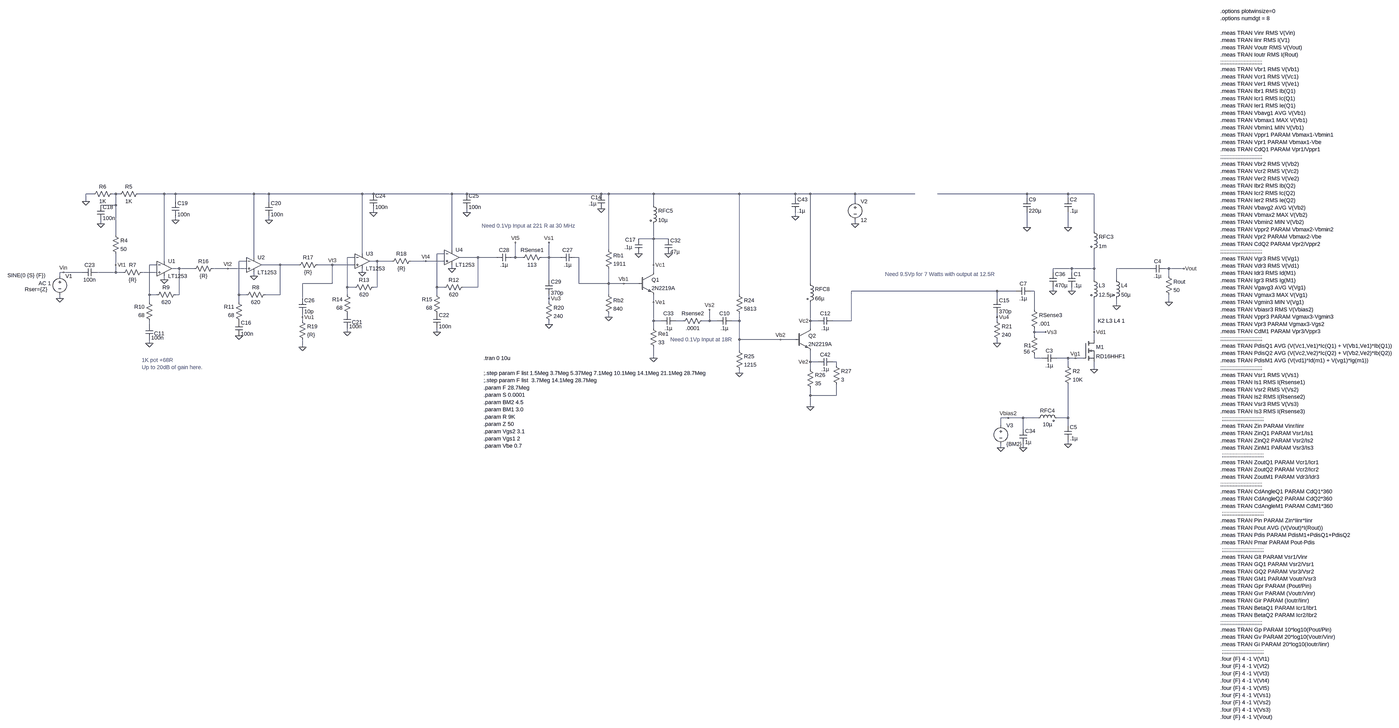
[diagram p0: schematic Temp.asc, whole sheet]
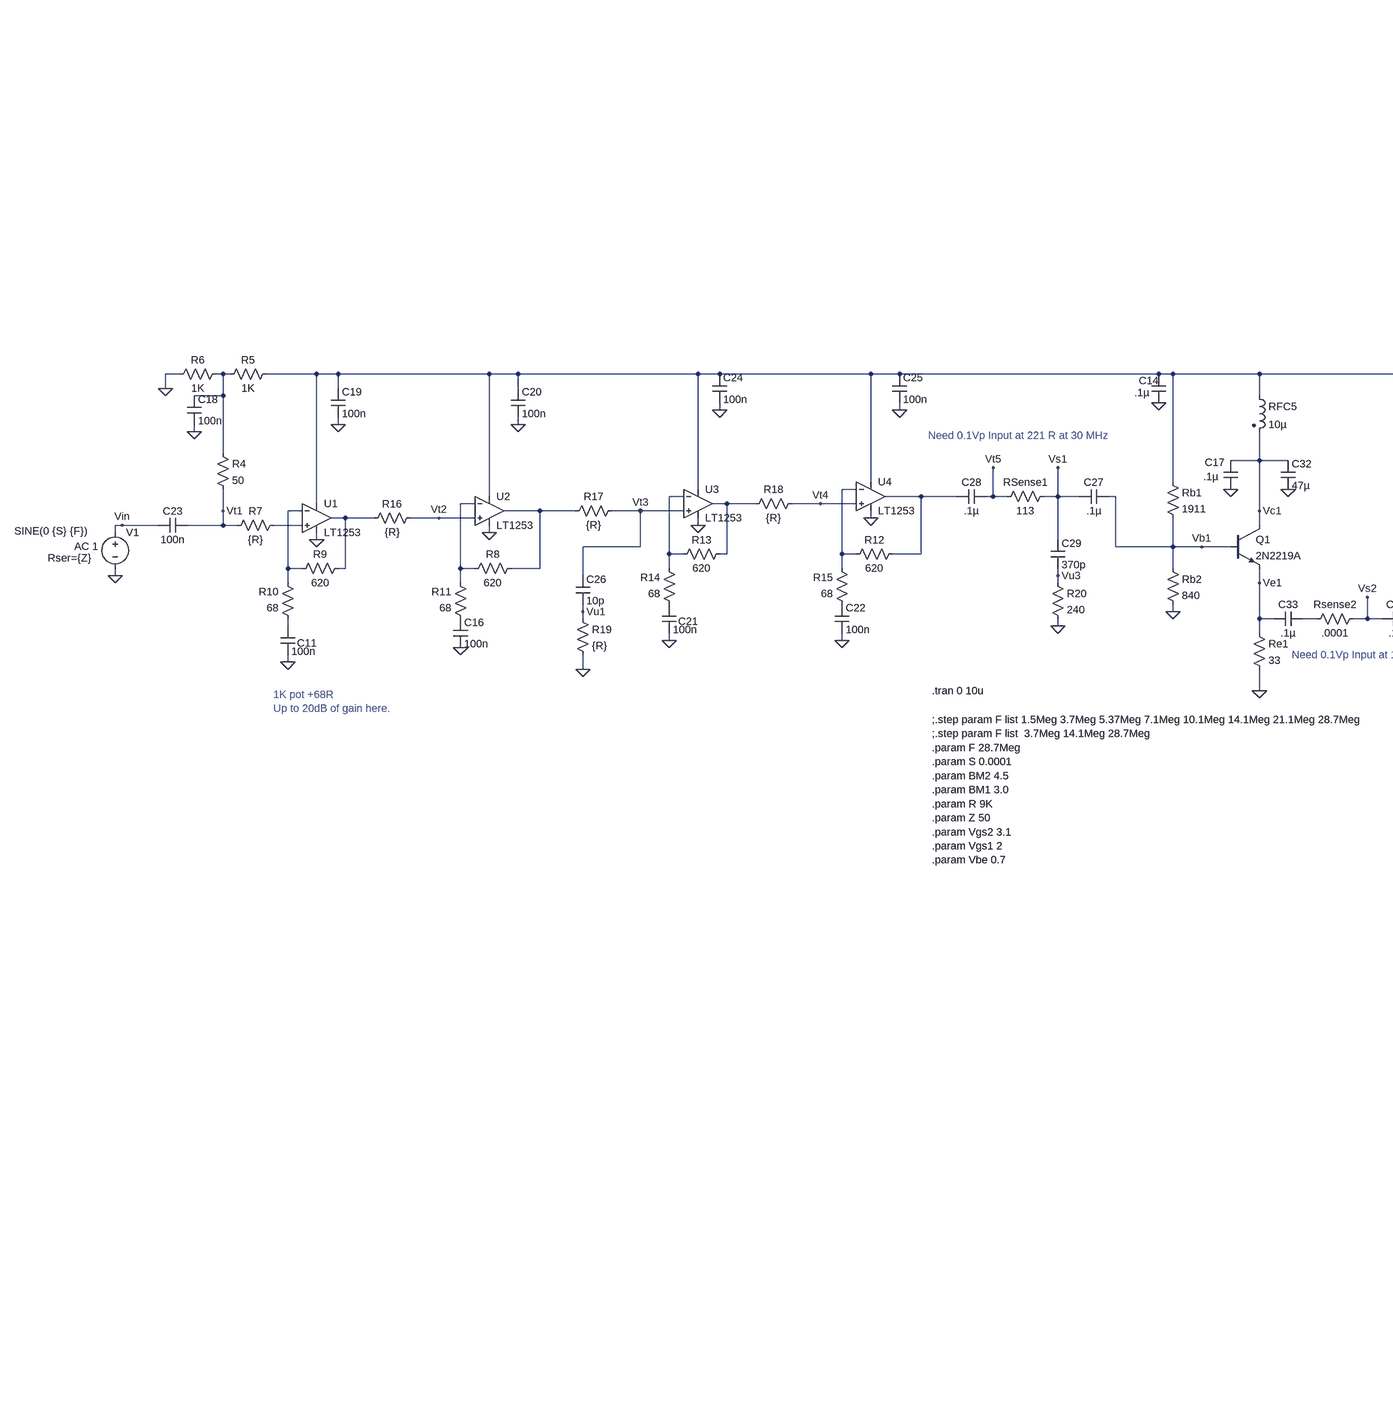
[diagram p1: schematic Temp.asc, part, row 1 of 1, column 1 of 2]
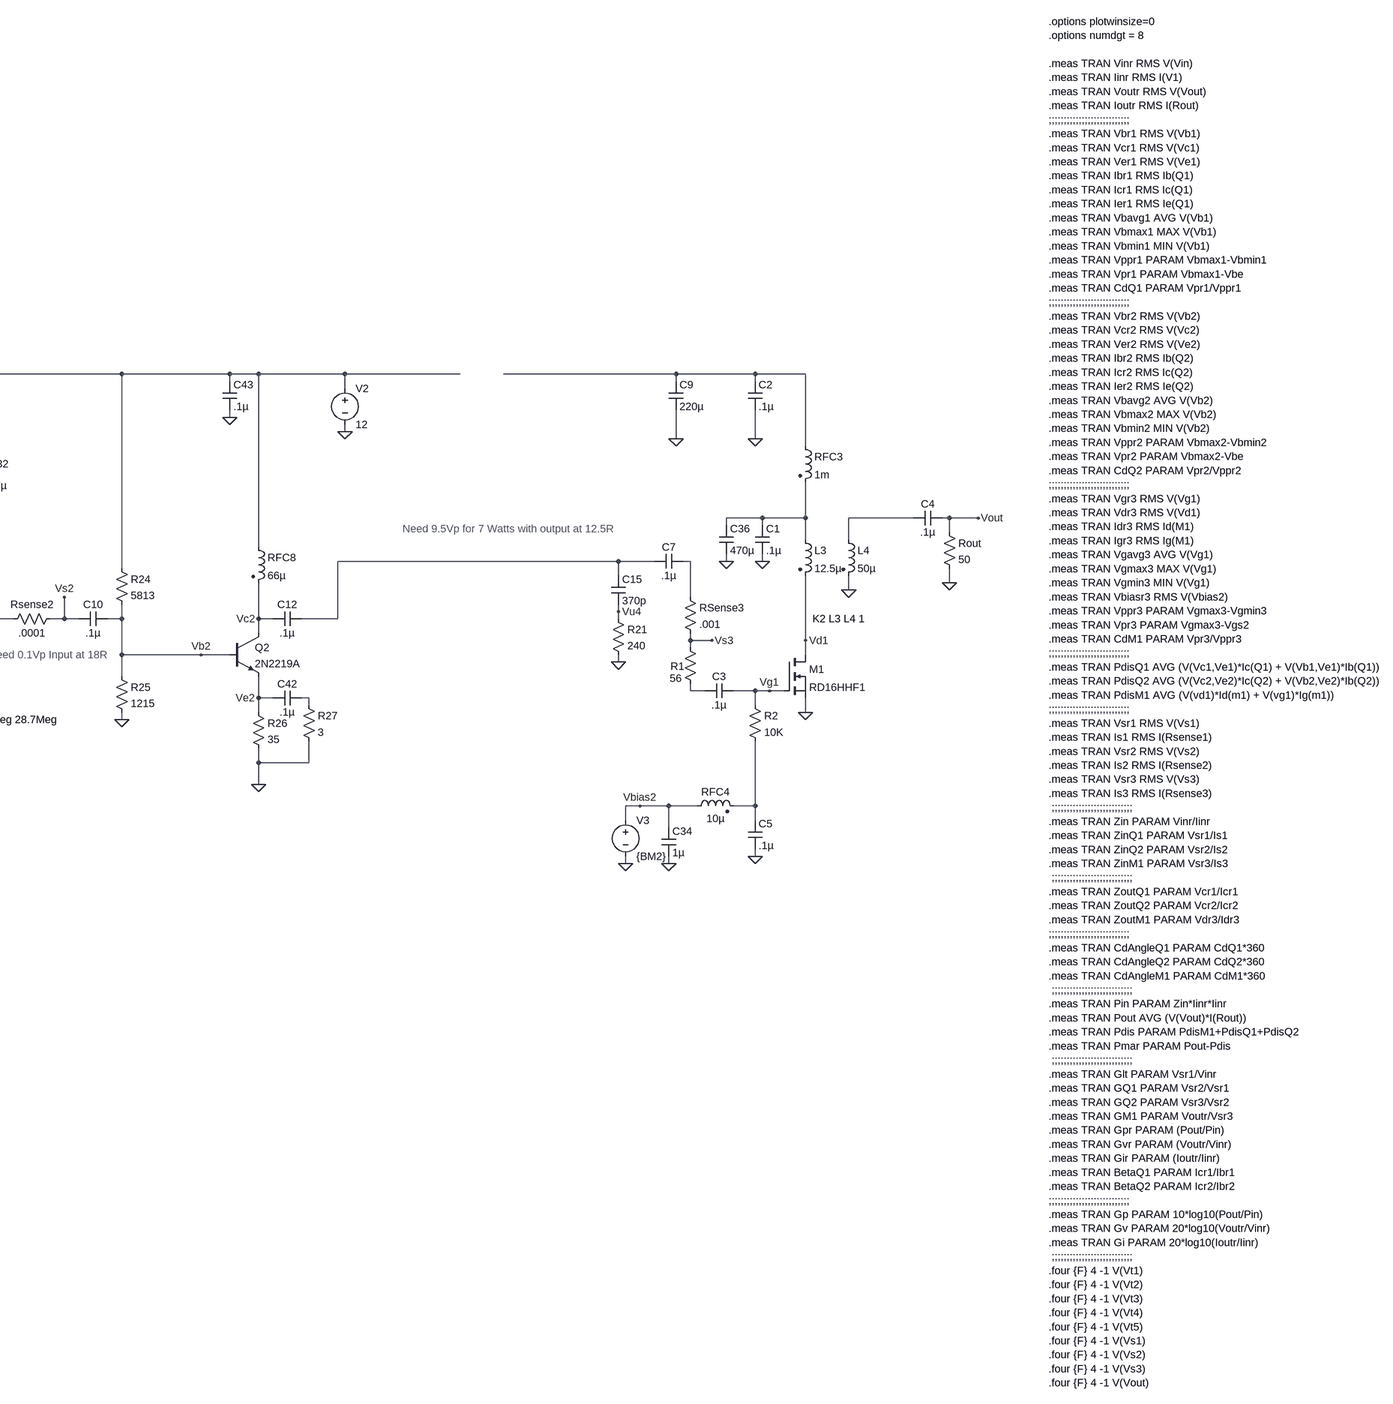
[diagram p2: schematic Temp.asc, part, row 1 of 1, column 2 of 2]
Temp.asc, the LTspice schematic file:
Version 4
SHEET 1 3484 2880
WIRE -3168 -160 -3200 -160
WIRE -3072 -160 -3088 -160
WIRE -3056 -160 -3072 -160
WIRE -2864 -160 -2976 -160
WIRE -2816 -160 -2864 -160
WIRE -2480 -160 -2816 -160
WIRE -2416 -160 -2480 -160
WIRE -2016 -160 -2416 -160
WIRE -1968 -160 -2016 -160
WIRE -1632 -160 -1968 -160
WIRE -1568 -160 -1632 -160
WIRE -992 -160 -1568 -160
WIRE -960 -160 -992 -160
WIRE -768 -160 -960 -160
WIRE -400 -160 -768 -160
WIRE -160 -160 -400 -160
WIRE -96 -160 -160 -160
WIRE 96 -160 -96 -160
WIRE 352 -160 96 -160
WIRE 832 -160 448 -160
WIRE 1008 -160 832 -160
WIRE 1120 -160 1008 -160
WIRE -160 -144 -160 -160
WIRE 832 -144 832 -160
WIRE 1008 -144 1008 -160
WIRE -3200 -128 -3200 -160
WIRE -2816 -128 -2816 -160
WIRE -2416 -128 -2416 -160
WIRE 96 -128 96 -160
WIRE -3072 -112 -3072 -160
WIRE -3072 -112 -3136 -112
WIRE -768 -112 -768 -160
WIRE -1968 -80 -1968 -96
WIRE -1568 -80 -1568 -96
WIRE -160 -64 -160 -80
WIRE -2816 -48 -2816 -64
WIRE -2416 -48 -2416 -64
WIRE -3136 -32 -3136 -48
WIRE 96 -32 96 -48
WIRE 832 -16 832 -80
WIRE 1008 -16 1008 -80
WIRE 1120 0 1120 -160
WIRE -3072 16 -3072 -112
WIRE -768 32 -768 -32
WIRE -768 32 -832 32
WIRE -704 32 -768 32
WIRE -1632 80 -1632 -160
WIRE -960 80 -960 -160
WIRE -2016 96 -2016 -160
WIRE -1664 96 -1696 96
WIRE -2480 112 -2480 -160
WIRE -2048 112 -2080 112
WIRE -1520 112 -1600 112
WIRE -1440 112 -1520 112
WIRE -1360 112 -1360 48
WIRE -1360 112 -1376 112
WIRE -1328 112 -1360 112
WIRE -1216 112 -1216 48
WIRE -1216 112 -1248 112
WIRE -1168 112 -1216 112
WIRE -1088 112 -1104 112
WIRE -2864 128 -2864 -160
WIRE -2512 128 -2544 128
WIRE -1952 128 -1984 128
WIRE -1888 128 -1952 128
WIRE -1744 128 -1808 128
WIRE -1664 128 -1744 128
WIRE -3072 144 -3072 96
WIRE -2896 144 -2928 144
WIRE -2368 144 -2448 144
WIRE -2288 144 -2368 144
WIRE -2144 144 -2208 144
WIRE -2048 144 -2144 144
WIRE -768 144 -768 32
WIRE -2800 160 -2832 160
WIRE -2736 160 -2800 160
WIRE -2592 160 -2656 160
WIRE -2512 160 -2592 160
WIRE -1632 160 -1632 144
WIRE 1024 160 944 160
WIRE 1120 160 1120 80
WIRE 1120 160 1024 160
WIRE 1360 160 1216 160
WIRE 1440 160 1424 160
WIRE 1504 160 1440 160
WIRE -3296 176 -3312 176
WIRE -3216 176 -3296 176
WIRE -3072 176 -3072 144
WIRE -3072 176 -3152 176
WIRE -3040 176 -3072 176
WIRE -2896 176 -2960 176
WIRE -2016 176 -2016 160
WIRE -768 176 -768 144
WIRE 944 176 944 160
WIRE 1024 176 1024 160
WIRE -3312 192 -3312 176
WIRE -2480 192 -2480 176
WIRE 1440 192 1440 160
WIRE -2864 208 -2864 192
WIRE -1216 208 -1216 112
WIRE 1120 208 1120 160
WIRE 1216 208 1216 160
WIRE -2144 224 -2144 144
WIRE -2144 224 -2272 224
WIRE -1088 224 -1088 112
WIRE -960 224 -960 160
WIRE -960 224 -1088 224
WIRE -896 224 -960 224
WIRE -832 224 -896 224
WIRE -96 224 -96 -160
WIRE -2080 240 -2080 112
WIRE -2048 240 -2080 240
WIRE -1952 240 -1952 128
WIRE -1952 240 -1968 240
WIRE -1696 240 -1696 96
WIRE -1664 240 -1696 240
WIRE -1520 240 -1520 112
WIRE -1520 240 -1584 240
WIRE 704 256 80 256
WIRE 784 256 704 256
WIRE 864 256 848 256
WIRE 944 256 944 240
WIRE 1024 256 1024 240
WIRE -2928 272 -2928 144
WIRE -2896 272 -2928 272
WIRE -2800 272 -2800 160
WIRE -2800 272 -2816 272
WIRE -2544 272 -2544 128
WIRE -2512 272 -2544 272
WIRE -2368 272 -2368 144
WIRE -2368 272 -2432 272
WIRE -2080 272 -2080 240
WIRE -1696 272 -1696 240
WIRE -960 272 -960 224
WIRE -400 272 -400 -160
WIRE -3312 288 -3312 272
WIRE -2272 288 -2272 224
WIRE -1216 288 -1216 272
WIRE 704 288 704 256
WIRE -2928 304 -2928 272
WIRE -2544 304 -2544 272
WIRE -1216 304 -1216 288
WIRE -768 304 -768 272
WIRE 1440 304 1440 272
WIRE 1216 320 1216 288
WIRE 864 336 864 256
WIRE -2272 368 -2272 352
WIRE -960 368 -960 352
WIRE 704 368 704 352
WIRE -2272 384 -2272 368
WIRE -768 384 -768 304
WIRE -736 384 -768 384
WIRE -640 384 -672 384
WIRE -528 384 -528 336
WIRE -528 384 -560 384
WIRE -496 384 -528 384
WIRE -400 384 -400 352
WIRE -400 384 -432 384
WIRE -96 384 -96 304
WIRE -64 384 -96 384
WIRE 80 384 80 256
WIRE 80 384 0 384
WIRE 704 384 704 368
WIRE -2928 400 -2928 384
WIRE -1216 400 -1216 384
WIRE -768 416 -768 384
WIRE -96 416 -96 384
WIRE -2080 432 -2080 416
WIRE -1696 432 -1696 416
WIRE 864 432 864 416
WIRE 912 432 864 432
WIRE 1120 432 1120 288
WIRE 864 448 864 432
WIRE -400 464 -400 384
WIRE -224 464 -400 464
WIRE -160 464 -224 464
WIRE 1120 464 1120 432
WIRE -2928 480 -2928 464
WIRE 704 480 704 464
WIRE -2272 496 -2272 464
WIRE -400 512 -400 464
WIRE -768 544 -768 496
WIRE 864 544 864 528
WIRE 896 544 864 544
WIRE 1008 544 960 544
WIRE 1040 544 1008 544
WIRE 1072 544 1040 544
WIRE -96 560 -96 512
WIRE -64 560 -96 560
WIRE 16 560 0 560
WIRE 16 576 16 560
WIRE 1008 576 1008 544
WIRE -96 592 -96 560
WIRE 1120 592 1120 560
WIRE -400 608 -400 592
WIRE -96 704 -96 672
WIRE 16 704 16 656
WIRE 16 704 -96 704
WIRE -96 752 -96 704
WIRE 752 800 720 800
WIRE 816 800 752 800
WIRE 880 800 816 800
WIRE 1008 800 1008 656
WIRE 1008 800 960 800
WIRE 720 832 720 800
WIRE 1008 832 1008 800
WIRE 816 848 816 800
WIRE 1008 912 1008 896
WIRE 720 928 720 912
WIRE 816 928 816 912
FLAG 1440 304 0
FLAG 1504 160 Vout
FLAG -3312 288 0
FLAG -3296 176 Vin
FLAG 1120 592 0
FLAG 1040 544 Vg1
FLAG 1120 432 Vd1
FLAG 1024 256 0
FLAG 1008 -16 0
FLAG 1216 320 0
FLAG 1008 912 0
FLAG 912 432 Vs3
FLAG 720 928 0
FLAG 752 800 Vbias2
FLAG 832 -16 0
FLAG 944 256 0
FLAG -960 368 0
FLAG -768 544 0
FLAG -896 224 Vb1
FLAG -768 304 Ve1
FLAG -768 144 Vc1
FLAG -992 -96 0
FLAG -832 96 0
FLAG -704 96 0
FLAG 704 368 Vu4
FLAG 704 480 0
FLAG 816 928 0
FLAG 96 -32 0
FLAG -400 608 0
FLAG -96 752 0
FLAG -224 464 Vb2
FLAG -96 560 Ve2
FLAG -96 384 Vc2
FLAG -160 -64 0
FLAG -528 336 Vs2
FLAG -2816 -48 0
FLAG -3136 -32 0
FLAG -2864 208 0
FLAG -2480 192 0
FLAG -2544 448 0
FLAG -2416 -48 0
FLAG -3200 -128 0
FLAG -2928 480 0
FLAG -1968 -80 0
FLAG -2016 176 0
FLAG -1632 160 0
FLAG -1696 432 0
FLAG -1568 -80 0
FLAG -2080 432 0
FLAG -2272 368 Vu1
FLAG -2272 496 0
FLAG -1216 48 Vs1
FLAG -3072 144 Vt1
FLAG -2592 160 Vt2
FLAG -2144 144 Vt3
FLAG -1360 48 Vt5
FLAG -1744 128 Vt4
FLAG -1216 288 Vu3
FLAG -1216 400 0
SYMBOL res 1424 176 R0
SYMATTR InstName Rout
SYMATTR Value 50
SYMBOL voltage -3312 176 R0
WINDOW 123 -91 47 Left 2
WINDOW 39 -150 73 Left 2
WINDOW 3 -224 13 Left 2
SYMATTR Value2 AC 1
SYMATTR SpiceLine Rser={Z}
SYMATTR Value SINE(0 {S} {F})
SYMATTR InstName V1
SYMBOL cap 1360 176 R270
WINDOW 0 32 32 VTop 2
WINDOW 3 0 32 VBottom 2
SYMATTR InstName C4
SYMATTR Value .1µ
SYMBOL nmos 1072 464 R0
SYMATTR InstName M1
SYMATTR Value RD16HHF1
SYMBOL ind2 1104 192 R0
SYMATTR InstName L3
SYMATTR Value 12.5µ
SYMATTR Type ind
SYMBOL ind2 1104 -16 R0
SYMATTR InstName RFC3
SYMATTR Value 1m
SYMATTR Type ind
SYMBOL cap 1008 176 R0
SYMATTR InstName C1
SYMATTR Value .1µ
SYMBOL ind2 1200 192 R0
SYMATTR InstName L4
SYMATTR Value 50µ
SYMATTR Type ind
SYMBOL cap 992 -144 R0
SYMATTR InstName C2
SYMATTR Value .1µ
SYMBOL res 848 320 R0
SYMATTR InstName RSense3
SYMATTR Value .001
SYMBOL cap 960 528 R90
WINDOW 0 0 32 VBottom 2
WINDOW 3 32 32 VTop 2
SYMATTR InstName C3
SYMATTR Value .1µ
SYMBOL res 992 560 R0
SYMATTR InstName R2
SYMATTR Value 10K
SYMBOL ind2 864 816 R270
WINDOW 0 32 56 VTop 2
WINDOW 3 4 56 VBottom 2
SYMATTR InstName RFC4
SYMATTR Value 10µ
SYMATTR Type ind
SYMBOL cap 992 832 R0
SYMATTR InstName C5
SYMATTR Value .1µ
SYMBOL cap 784 272 R270
WINDOW 0 32 32 VTop 2
WINDOW 3 0 32 VBottom 2
SYMATTR InstName C7
SYMATTR Value .1µ
SYMBOL voltage 720 816 R0
WINDOW 123 0 0 Left 2
WINDOW 39 0 0 Left 2
SYMATTR InstName V3
SYMATTR Value {BM2}
SYMBOL cap 816 -144 R0
SYMATTR InstName C9
SYMATTR Value 220µ
SYMBOL cap 928 176 R0
SYMATTR InstName C36
SYMATTR Value 470µ
SYMBOL res 848 432 R0
WINDOW 0 -28 58 Left 2
WINDOW 3 -30 84 Left 2
SYMATTR InstName R1
SYMATTR Value 56
SYMBOL res -976 64 R0
SYMATTR InstName Rb1
SYMATTR Value 1911
SYMBOL res -976 256 R0
SYMATTR InstName Rb2
SYMATTR Value 840
SYMBOL res -784 400 R0
SYMATTR InstName Re1
SYMATTR Value 33
SYMBOL npn -832 176 R0
SYMATTR InstName Q1
SYMATTR Value 2N2219A
SYMBOL cap -1008 -160 R0
WINDOW 0 -28 15 Left 2
WINDOW 3 -38 41 Left 2
SYMATTR InstName C14
SYMATTR Value .1µ
SYMBOL cap -848 32 R0
WINDOW 0 -41 4 Left 2
WINDOW 3 -45 36 Left 2
SYMATTR InstName C17
SYMATTR Value .1µ
SYMBOL cap -3152 160 R90
WINDOW 0 0 32 VBottom 2
WINDOW 3 32 32 VTop 2
SYMATTR InstName C23
SYMATTR Value 100n
SYMBOL ind2 -784 -128 R0
SYMATTR InstName RFC5
SYMATTR Value 10µ
SYMATTR Type ind
SYMBOL cap -720 32 R0
SYMATTR InstName C32
SYMATTR Value 47µ
SYMBOL cap -736 400 R270
WINDOW 0 32 32 VTop 2
WINDOW 3 0 32 VBottom 2
SYMATTR InstName C33
SYMATTR Value .1µ
SYMBOL cap 688 288 R0
SYMATTR InstName C15
SYMATTR Value 370p
SYMBOL res 688 368 R0
SYMATTR InstName R21
SYMATTR Value 240
SYMBOL cap 800 848 R0
SYMATTR InstName C34
SYMATTR Value 1µ
SYMBOL voltage 96 -144 R0
WINDOW 123 0 0 Left 2
WINDOW 39 0 0 Left 2
SYMATTR InstName V2
SYMATTR Value 12
SYMBOL cap -64 400 R270
WINDOW 0 32 32 VTop 2
WINDOW 3 0 32 VBottom 2
SYMATTR InstName C12
SYMATTR Value .1µ
SYMBOL res -416 256 R0
SYMATTR InstName R24
SYMATTR Value 5813
SYMBOL res -416 496 R0
SYMATTR InstName R25
SYMATTR Value 1215
SYMBOL res -112 576 R0
SYMATTR InstName R26
SYMATTR Value 35
SYMBOL cap 0 544 R90
WINDOW 0 0 32 VBottom 2
WINDOW 3 32 32 VTop 2
SYMATTR InstName C42
SYMATTR Value .1µ
SYMBOL npn -160 416 R0
SYMATTR InstName Q2
SYMATTR Value 2N2219A
SYMBOL res 0 560 R0
SYMATTR InstName R27
SYMATTR Value 3
SYMBOL ind2 -112 208 R0
SYMATTR InstName RFC8
SYMATTR Value 66µ
SYMATTR Type ind
SYMBOL cap -176 -144 R0
SYMATTR InstName C43
SYMATTR Value .1µ
SYMBOL res -544 368 R90
WINDOW 0 0 56 VBottom 2
WINDOW 3 32 56 VTop 2
SYMATTR InstName Rsense2
SYMATTR Value .0001
SYMBOL cap -496 400 R270
WINDOW 0 32 32 VTop 2
WINDOW 3 0 32 VBottom 2
SYMATTR InstName C10
SYMATTR Value .1µ
SYMBOL Opamps\\LT1253 -2864 96 R0
SYMATTR InstName U1
SYMBOL Opamps\\LT1253 -2480 80 R0
SYMATTR InstName U2
SYMBOL res -3088 0 R0
SYMATTR InstName R4
SYMATTR Value 50
SYMBOL res -2960 -176 R90
WINDOW 0 0 56 VBottom 2
WINDOW 3 32 56 VTop 2
SYMATTR InstName R5
SYMATTR Value 1K
SYMBOL res -3072 -176 R90
WINDOW 0 0 56 VBottom 2
WINDOW 3 32 56 VTop 2
SYMATTR InstName R6
SYMATTR Value 1K
SYMBOL res -2944 160 R90
WINDOW 0 0 56 VBottom 2
WINDOW 3 32 56 VTop 2
SYMATTR InstName R7
SYMATTR Value {R}
SYMBOL res -2416 256 R90
WINDOW 0 0 56 VBottom 2
WINDOW 3 32 56 VTop 2
SYMATTR InstName R8
SYMATTR Value 620
SYMBOL res -2800 256 R90
WINDOW 0 0 56 VBottom 2
WINDOW 3 32 56 VTop 2
SYMATTR InstName R9
SYMATTR Value 620
SYMBOL res -2912 400 R180
WINDOW 0 36 76 Left 2
WINDOW 3 36 40 Left 2
SYMATTR InstName R10
SYMATTR Value 68
SYMBOL res -2528 400 R180
WINDOW 0 36 76 Left 2
WINDOW 3 36 40 Left 2
SYMATTR InstName R11
SYMATTR Value 68
SYMBOL cap -2944 400 R0
WINDOW 0 36 38 Left 2
SYMATTR InstName C11
SYMATTR Value 100n
SYMBOL cap -2560 384 R0
SYMATTR InstName C16
SYMATTR Value 100n
SYMBOL cap -3152 -112 R0
SYMATTR InstName C18
SYMATTR Value 100n
SYMBOL cap -2832 -128 R0
SYMATTR InstName C19
SYMATTR Value 100n
SYMBOL cap -2432 -128 R0
SYMATTR InstName C20
SYMATTR Value 100n
SYMBOL Opamps\\LT1253 -2016 64 R0
SYMATTR InstName U3
SYMBOL Opamps\\LT1253 -1632 48 R0
SYMATTR InstName U4
SYMBOL res -1568 224 R90
WINDOW 0 0 56 VBottom 2
WINDOW 3 32 56 VTop 2
SYMATTR InstName R12
SYMATTR Value 620
SYMBOL res -1952 224 R90
WINDOW 0 0 56 VBottom 2
WINDOW 3 32 56 VTop 2
SYMATTR InstName R13
SYMATTR Value 620
SYMBOL res -2064 368 R180
WINDOW 0 36 76 Left 2
WINDOW 3 36 40 Left 2
SYMATTR InstName R14
SYMATTR Value 68
SYMBOL res -1680 368 R180
WINDOW 0 36 76 Left 2
WINDOW 3 36 40 Left 2
SYMATTR InstName R15
SYMATTR Value 68
SYMBOL cap -2096 352 R0
WINDOW 0 36 38 Left 2
SYMATTR InstName C21
SYMATTR Value 100n
SYMBOL cap -1712 352 R0
SYMATTR InstName C22
SYMATTR Value 100n
SYMBOL cap -1984 -160 R0
SYMATTR InstName C24
SYMATTR Value 100n
SYMBOL cap -1584 -160 R0
SYMATTR InstName C25
SYMATTR Value 100n
SYMBOL res -2640 144 R90
WINDOW 0 0 56 VBottom 2
WINDOW 3 32 56 VTop 2
SYMATTR InstName R16
SYMATTR Value {R}
SYMBOL res -2192 128 R90
WINDOW 0 0 56 VBottom 2
WINDOW 3 32 56 VTop 2
SYMATTR InstName R17
SYMATTR Value {R}
SYMBOL res -1792 112 R90
WINDOW 0 0 56 VBottom 2
WINDOW 3 32 56 VTop 2
SYMATTR InstName R18
SYMATTR Value {R}
SYMBOL cap -2288 288 R0
SYMATTR InstName C26
SYMATTR Value 10p
SYMBOL res -2288 368 R0
SYMATTR InstName R19
SYMATTR Value {R}
SYMBOL cap -1168 128 R270
WINDOW 0 32 32 VTop 2
WINDOW 3 0 32 VBottom 2
SYMATTR InstName C27
SYMATTR Value .1µ
SYMBOL cap -1440 128 R270
WINDOW 0 32 32 VTop 2
WINDOW 3 0 32 VBottom 2
SYMATTR InstName C28
SYMATTR Value .1µ
SYMBOL res -1232 96 R90
WINDOW 0 0 56 VBottom 2
WINDOW 3 32 56 VTop 2
SYMATTR InstName RSense1
SYMATTR Value 113
SYMBOL cap -1232 208 R0
SYMATTR InstName C29
SYMATTR Value 370p
SYMBOL res -1232 288 R0
SYMATTR InstName R20
SYMATTR Value 240
TEXT -1496 544 Left 2 !.tran 0 10u
TEXT 2696 -944 Left 2 !.options plotwinsize=0\n.options numdgt = 8\n \n.meas TRAN Vinr RMS V(Vin)\n.meas TRAN Iinr RMS I(V1)\n.meas TRAN Voutr RMS V(Vout)\n.meas TRAN Ioutr RMS I(Rout)\n;;;;;;;;;;;;;;;;;;;;;;;;;;;\n.meas TRAN Vbr1 RMS V(Vb1)\n.meas TRAN Vcr1 RMS V(Vc1)\n.meas TRAN Ver1 RMS V(Ve1)\n.meas TRAN Ibr1 RMS Ib(Q1)\n.meas TRAN Icr1 RMS Ic(Q1)\n.meas TRAN Ier1 RMS Ie(Q1)\n.meas TRAN Vbavg1 AVG V(Vb1)\n.meas TRAN Vbmax1 MAX V(Vb1)\n.meas TRAN Vbmin1 MIN V(Vb1)\n.meas TRAN Vppr1 PARAM Vbmax1-Vbmin1\n.meas TRAN Vpr1 PARAM Vbmax1-Vbe\n.meas TRAN CdQ1 PARAM Vpr1/Vppr1\n;;;;;;;;;;;;;;;;;;;;;;;;;;;\n.meas TRAN Vbr2 RMS V(Vb2)\n.meas TRAN Vcr2 RMS V(Vc2)\n.meas TRAN Ver2 RMS V(Ve2)\n.meas TRAN Ibr2 RMS Ib(Q2)\n.meas TRAN Icr2 RMS Ic(Q2)\n.meas TRAN Ier2 RMS Ie(Q2)\n.meas TRAN Vbavg2 AVG V(Vb2)\n.meas TRAN Vbmax2 MAX V(Vb2)\n.meas TRAN Vbmin2 MIN V(Vb2)\n.meas TRAN Vppr2 PARAM Vbmax2-Vbmin2\n.meas TRAN Vpr2 PARAM Vbmax2-Vbe\n.meas TRAN CdQ2 PARAM Vpr2/Vppr2\n;;;;;;;;;;;;;;;;;;;;;;;;;;;\n.meas TRAN Vgr3 RMS V(Vg1)\n.meas TRAN Vdr3 RMS V(Vd1)\n.meas TRAN Idr3 RMS Id(M1)\n.meas TRAN Igr3 RMS Ig(M1)\n.meas TRAN Vgavg3 AVG V(Vg1)\n.meas TRAN Vgmax3 MAX V(Vg1)\n.meas TRAN Vgmin3 MIN V(Vg1)\n.meas TRAN Vbiasr3 RMS V(Vbias2)\n.meas TRAN Vppr3 PARAM Vgmax3-Vgmin3\n.meas TRAN Vpr3 PARAM Vgmax3-Vgs2\n.meas TRAN CdM1 PARAM Vpr3/Vppr3\n;;;;;;;;;;;;;;;;;;;;;;;;;;;\n.meas TRAN PdisQ1 AVG (V(Vc1,Ve1)*Ic(Q1) + V(Vb1,Ve1)*Ib(Q1))\n.meas TRAN PdisQ2 AVG (V(Vc2,Ve2)*Ic(Q2) + V(Vb2,Ve2)*Ib(Q2))\n.meas TRAN PdisM1 AVG (V(vd1)*Id(m1) + V(vg1)*Ig(m1))\n;;;;;;;;;;;;;;;;;;;;;;;;;;;\n.meas TRAN Vsr1 RMS V(Vs1)\n.meas TRAN Is1 RMS I(Rsense1)\n.meas TRAN Vsr2 RMS V(Vs2)\n.meas TRAN Is2 RMS I(Rsense2)\n.meas TRAN Vsr3 RMS V(Vs3)\n.meas TRAN Is3 RMS I(Rsense3)\n ;;;;;;;;;;;;;;;;;;;;;;;;;;;\n.meas TRAN Zin PARAM Vinr/Iinr\n.meas TRAN ZinQ1 PARAM Vsr1/Is1\n.meas TRAN ZinQ2 PARAM Vsr2/Is2\n.meas TRAN ZinM1 PARAM Vsr3/Is3\n ;;;;;;;;;;;;;;;;;;;;;;;;;;; \n.meas TRAN ZoutQ1 PARAM Vcr1/Icr1\n.meas TRAN ZoutQ2 PARAM Vcr2/Icr2\n.meas TRAN ZoutM1 PARAM Vdr3/Idr3\n;;;;;;;;;;;;;;;;;;;;;;;;;;;\n.meas TRAN CdAngleQ1 PARAM CdQ1*360\n.meas TRAN CdAngleQ2 PARAM CdQ2*360\n.meas TRAN CdAngleM1 PARAM CdM1*360\n ;;;;;;;;;;;;;;;;;;;;;;;;;;;\n.meas TRAN Pin PARAM Zin*Iinr*Iinr\n.meas TRAN Pout AVG (V(Vout)*I(Rout))\n.meas TRAN Pdis PARAM PdisM1+PdisQ1+PdisQ2\n.meas TRAN Pmar PARAM Pout-Pdis\n ;;;;;;;;;;;;;;;;;;;;;;;;;;;\n.meas TRAN Glt PARAM Vsr1/Vinr\n.meas TRAN GQ1 PARAM Vsr2/Vsr1\n.meas TRAN GQ2 PARAM Vsr3/Vsr2\n.meas TRAN GM1 PARAM Voutr/Vsr3\n.meas TRAN Gpr PARAM (Pout/Pin)\n.meas TRAN Gvr PARAM (Voutr/Vinr)\n.meas TRAN Gir PARAM (Ioutr/Iinr)\n.meas TRAN BetaQ1 PARAM Icr1/Ibr1\n.meas TRAN BetaQ2 PARAM Icr2/Ibr2\n;;;;;;;;;;;;;;;;;;;;;;;;;;;\n.meas TRAN Gp PARAM 10*log10(Pout/Pin)\n.meas TRAN Gv PARAM 20*log10(Voutr/Vinr)\n.meas TRAN Gi PARAM 20*log10(Ioutr/Iinr)\n ;;;;;;;;;;;;;;;;;;;;;;;;;;;\n.four {F} 4 -1 V(Vt1)\n.four {F} 4 -1 V(Vt2)\n.four {F} 4 -1 V(Vt3)\n.four {F} 4 -1 V(Vt4)\n.four {F} 4 -1 V(Vt5)\n.four {F} 4 -1 V(Vs1)\n.four {F} 4 -1 V(Vs2)\n.four {F} 4 -1 V(Vs3)\n.four {F} 4 -1 V(Vout)
TEXT -1496 608 Left 2 !;.step param F list 1.5Meg 3.7Meg 5.37Meg 7.1Meg 10.1Meg 14.1Meg 21.1Meg 28.7Meg\n;.step param F list  3.7Meg 14.1Meg 28.7Meg\n.param F 28.7Meg\n.param S 0.0001\n.param BM2 4.5\n.param BM1 3.0\n.param R 9K\n.param Z 50\n.param Vgs2 3.1\n.param Vgs1 2\n.param Vbe 0.7
TEXT 1136 384 Left 2 !K2 L3 L4 1
TEXT 224 184 Left 2 ;Need 9.5Vp for 7 Watts with output at 12.5R
TEXT -1504 -24 Left 2 ;Need 0.1Vp Input at 221 R at 30 MHz
TEXT -696 464 Left 2 ;Need 0.1Vp Input at 18R
TEXT -2960 552 Left 2 ;1K pot +68R  \nUp to 20dB of gain here.

The netlist it stands for:
* Temp.asc
Rout Vout 0 50
V1 Vin 0 SINE(0 {S} {F}) AC 1 Rser={Z}
C4 N013 Vout .1µ
M1 Vd1 Vg1 0 0 RD16HHF1
L3 N012 Vd1 12.5µ
L§RFC3 N003 N012 1m
C1 N012 0 .1µ
L4 N013 0 50µ
C2 N003 0 .1µ
RSense3 N016 Vs3 .001
C3 Vg1 N019 .1µ
R2 Vg1 N021 10K
L§RFC4 Vbias2 N021 10µ
C5 N021 0 .1µ
C7 N015 N016 .1µ
V3 Vbias2 0 {BM2}
C9 N003 0 220µ
C36 N012 0 470µ
R1 Vs3 N019 56
Rb1 N002 Vb1 1911
Rb2 Vb1 0 840
Re1 Ve1 0 33
Q1 Vc1 Vb1 Ve1 0 2N2219A
C14 N002 0 .1µ
C17 Vc1 0 .1µ
C23 Vt1 Vin 100n
L§RFC5 N002 Vc1 10µ
C32 Vc1 0 47µ
C33 Ve1 N017 .1µ
C15 N015 Vu4 370p
R21 Vu4 0 240
C34 Vbias2 0 1µ
V2 N002 0 12
C12 Vc2 N015 .1µ
R24 N002 Vb2 5813
R25 Vb2 0 1215
R26 Ve2 0 35
C42 N020 Ve2 .1µ
Q2 Vc2 Vb2 Ve2 0 2N2219A
R27 N020 0 3
L§RFC8 N002 Vc2 66µ
C43 N002 0 .1µ
Rsense2 Vs2 N017 .0001
C10 Vs2 Vb2 .1µ
XU1 N014 N009 N002 0 N011 LT1253  ; pins In+ In- V+ V- OUT
XU2 Vt2 N007 N002 0 N010 LT1253  ; pins In+ In- V+ V- OUT
R4 N001 Vt1 50
R5 N002 N001 1K
R6 N001 0 1K
R7 N014 Vt1 {R}
R8 N010 N007 620
R9 N011 N009 620
R10 N018 N009 68
R11 P001 N007 68
C11 N018 0 100n
C16 P001 0 100n
C18 N001 0 100n
C19 N002 0 100n
C20 N002 0 100n
XU3 Vt3 N005 N002 0 N008 LT1253  ; pins In+ In- V+ V- OUT
XU4 Vt4 N004 N002 0 N006 LT1253  ; pins In+ In- V+ V- OUT
R12 N006 N004 620
R13 N008 N005 620
R14 P002 N005 68
R15 P003 N004 68
C21 P002 0 100n
C22 P003 0 100n
C24 N002 0 100n
C25 N002 0 100n
R16 Vt2 N011 {R}
R17 Vt3 N010 {R}
R18 Vt4 N008 {R}
C26 Vt3 Vu1 10p
R19 Vu1 0 {R}
C27 Vs1 Vb1 .1µ
C28 N006 Vt5 .1µ
RSense1 Vs1 Vt5 113
C29 Vs1 Vu3 370p
R20 Vu3 0 240
.model NPN NPN
.model PNP PNP
.lib standard.bjt
.model NMOS NMOS
.model PMOS PMOS
.lib standard.mos
.tran 0 10u
.options plotwinsize=0
.options numdgt = 8
.meas TRAN Vinr RMS V(Vin)
.meas TRAN Iinr RMS I(V1)
.meas TRAN Voutr RMS V(Vout)
.meas TRAN Ioutr RMS I(Rout)
;;;;;;;;;;;;;;;;;;;;;;;;;;;
.meas TRAN Vbr1 RMS V(Vb1)
.meas TRAN Vcr1 RMS V(Vc1)
.meas TRAN Ver1 RMS V(Ve1)
.meas TRAN Ibr1 RMS Ib(Q1)
.meas TRAN Icr1 RMS Ic(Q1)
.meas TRAN Ier1 RMS Ie(Q1)
.meas TRAN Vbavg1 AVG V(Vb1)
.meas TRAN Vbmax1 MAX V(Vb1)
.meas TRAN Vbmin1 MIN V(Vb1)
.meas TRAN Vppr1 PARAM Vbmax1-Vbmin1
.meas TRAN Vpr1 PARAM Vbmax1-Vbe
.meas TRAN CdQ1 PARAM Vpr1/Vppr1
;;;;;;;;;;;;;;;;;;;;;;;;;;;
.meas TRAN Vbr2 RMS V(Vb2)
.meas TRAN Vcr2 RMS V(Vc2)
.meas TRAN Ver2 RMS V(Ve2)
.meas TRAN Ibr2 RMS Ib(Q2)
.meas TRAN Icr2 RMS Ic(Q2)
.meas TRAN Ier2 RMS Ie(Q2)
.meas TRAN Vbavg2 AVG V(Vb2)
.meas TRAN Vbmax2 MAX V(Vb2)
.meas TRAN Vbmin2 MIN V(Vb2)
.meas TRAN Vppr2 PARAM Vbmax2-Vbmin2
.meas TRAN Vpr2 PARAM Vbmax2-Vbe
.meas TRAN CdQ2 PARAM Vpr2/Vppr2
;;;;;;;;;;;;;;;;;;;;;;;;;;;
.meas TRAN Vgr3 RMS V(Vg1)
.meas TRAN Vdr3 RMS V(Vd1)
.meas TRAN Idr3 RMS Id(M1)
.meas TRAN Igr3 RMS Ig(M1)
.meas TRAN Vgavg3 AVG V(Vg1)
.meas TRAN Vgmax3 MAX V(Vg1)
.meas TRAN Vgmin3 MIN V(Vg1)
.meas TRAN Vbiasr3 RMS V(Vbias2)
.meas TRAN Vppr3 PARAM Vgmax3-Vgmin3
.meas TRAN Vpr3 PARAM Vgmax3-Vgs2
.meas TRAN CdM1 PARAM Vpr3/Vppr3
;;;;;;;;;;;;;;;;;;;;;;;;;;;
.meas TRAN PdisQ1 AVG (V(Vc1,Ve1)*Ic(Q1) + V(Vb1,Ve1)*Ib(Q1))
.meas TRAN PdisQ2 AVG (V(Vc2,Ve2)*Ic(Q2) + V(Vb2,Ve2)*Ib(Q2))
.meas TRAN PdisM1 AVG (V(vd1)*Id(m1) + V(vg1)*Ig(m1))
;;;;;;;;;;;;;;;;;;;;;;;;;;;
.meas TRAN Vsr1 RMS V(Vs1)
.meas TRAN Is1 RMS I(Rsense1)
.meas TRAN Vsr2 RMS V(Vs2)
.meas TRAN Is2 RMS I(Rsense2)
.meas TRAN Vsr3 RMS V(Vs3)
.meas TRAN Is3 RMS I(Rsense3)
 ;;;;;;;;;;;;;;;;;;;;;;;;;;;
.meas TRAN Zin PARAM Vinr/Iinr
.meas TRAN ZinQ1 PARAM Vsr1/Is1
.meas TRAN ZinQ2 PARAM Vsr2/Is2
.meas TRAN ZinM1 PARAM Vsr3/Is3
 ;;;;;;;;;;;;;;;;;;;;;;;;;;;
.meas TRAN ZoutQ1 PARAM Vcr1/Icr1
.meas TRAN ZoutQ2 PARAM Vcr2/Icr2
.meas TRAN ZoutM1 PARAM Vdr3/Idr3
;;;;;;;;;;;;;;;;;;;;;;;;;;;
.meas TRAN CdAngleQ1 PARAM CdQ1*360
.meas TRAN CdAngleQ2 PARAM CdQ2*360
.meas TRAN CdAngleM1 PARAM CdM1*360
 ;;;;;;;;;;;;;;;;;;;;;;;;;;;
.meas TRAN Pin PARAM Zin*Iinr*Iinr
.meas TRAN Pout AVG (V(Vout)*I(Rout))
.meas TRAN Pdis PARAM PdisM1+PdisQ1+PdisQ2
.meas TRAN Pmar PARAM Pout-Pdis
 ;;;;;;;;;;;;;;;;;;;;;;;;;;;
.meas TRAN Glt PARAM Vsr1/Vinr
.meas TRAN GQ1 PARAM Vsr2/Vsr1
.meas TRAN GQ2 PARAM Vsr3/Vsr2
.meas TRAN GM1 PARAM Voutr/Vsr3
.meas TRAN Gpr PARAM (Pout/Pin)
.meas TRAN Gvr PARAM (Voutr/Vinr)
.meas TRAN Gir PARAM (Ioutr/Iinr)
.meas TRAN BetaQ1 PARAM Icr1/Ibr1
.meas TRAN BetaQ2 PARAM Icr2/Ibr2
;;;;;;;;;;;;;;;;;;;;;;;;;;;
.meas TRAN Gp PARAM 10*log10(Pout/Pin)
.meas TRAN Gv PARAM 20*log10(Voutr/Vinr)
.meas TRAN Gi PARAM 20*log10(Ioutr/Iinr)
 ;;;;;;;;;;;;;;;;;;;;;;;;;;;
.four {F} 4 -1 V(Vt1)
.four {F} 4 -1 V(Vt2)
.four {F} 4 -1 V(Vt3)
.four {F} 4 -1 V(Vt4)
.four {F} 4 -1 V(Vt5)
.four {F} 4 -1 V(Vs1)
.four {F} 4 -1 V(Vs2)
.four {F} 4 -1 V(Vs3)
.four {F} 4 -1 V(Vout)
;.step param F list 1.5Meg 3.7Meg 5.37Meg 7.1Meg 10.1Meg 14.1Meg 21.1Meg 28.7Meg
;.step param F list  3.7Meg 14.1Meg 28.7Meg
.param F 28.7Meg
.param S 0.0001
.param BM2 4.5
.param BM1 3.0
.param R 9K
.param Z 50
.param Vgs2 3.1
.param Vgs1 2
.param Vbe 0.7
K2 L3 L4 1
* Need 9.5Vp for 7 Watts with output at 12.5R
* Need 0.1Vp Input at 221 R at 30 MHz
* Need 0.1Vp Input at 18R
* 1K pot +68R
* Up to 20dB of gain here.
.backanno
.end